# EAGLE design sst_ur_01 (EAGLE 6.5.0)
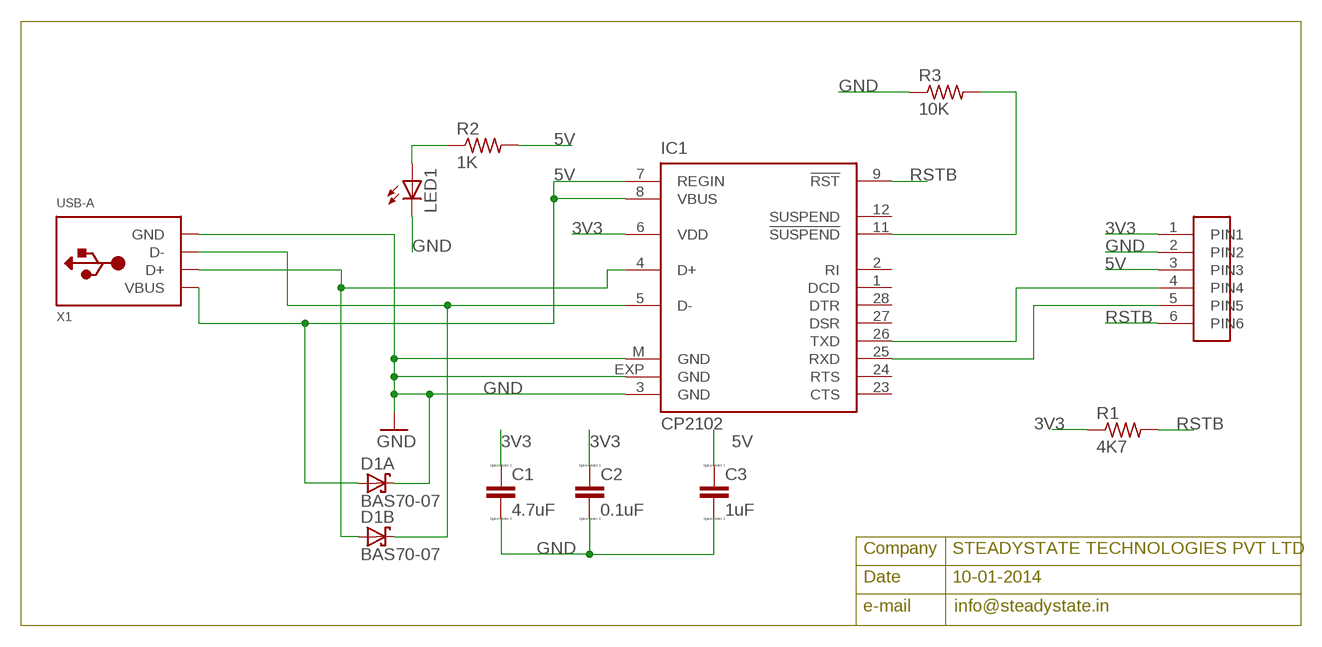
[diagram p0: schematic, sheet 1]

## Parts
C1  4.7uF  CC3216  [C3216]
C2  0.1uF  CC1206  [C1206]
C3  1uF  CC1206  [C1206]
D1  BAS70-07  [SOT143-R]
IC1  CP2102  [MLP28]
LED1  LEDCHIPLED_1206  [CHIPLED_1206]
R1  4K7  R-US_R1210  [R1210]
R2  1K  R-US_R1210  [R1210]
R3  10K  R-US_R1210  [R1210]
U$1  SIL6  [SIL6]
X1  USB-A  [MOLEX_480371000]

## Nets
3V3: C1.1 C2.1 IC1.6(VDD) R1.1 U$1.1(PIN1)
5V: C3.1 D1.4(A:A) IC1.7(REGIN) IC1.8(VBUS) R2.2 U$1.3(PIN3) X1.1(VBUS)
GND: C1.2 C2.2 C3.2 D1.1(A:C) IC1.3(GND) IC1.EXP(GND) IC1.M(GND) LED1.C R3.1 U$1.2(PIN2) X1.4(GND)
N$1: D1.2(B:C) IC1.5(D-) X1.2(D-)
N$2: IC1.11(!SUSPEND) R3.2
N$3: D1.3(B:A) IC1.4(D+) X1.3(D+)
N$4: LED1.A R2.1
N$7: IC1.26(TXD) U$1.4(PIN4)
N$8: IC1.25(RXD) U$1.5(PIN5)
RSTB: IC1.9(!RST) R1.2 U$1.6(PIN6)
Unconnected: IC1.1(DCD) IC1.2(RI) IC1.12(SUSPEND) IC1.23(CTS) IC1.24(RTS) IC1.27(DSR) IC1.28(DTR)

## Notes on the sheet
- Company | STEADYSTATE TECHNOLOGIES PVT LTD
- Date | 10-01-2014
- e-mail | info@steadystate.in

## Library data of the parts
C1-C3 = eagle-ltspice:C: CAPACITOR, European symbol; SPICEMODEL: NONE; SPICEPREFIX: C
D1 = diode:BAS70-07: Silicon Schottky Diodes General-purpose diode for high-speed switching Source: BAS70_1PS7XSB70_SER_8.pdf
IC1 = silabs:CP210*: Single-Chip USB to UART Bridge Source: www.silabs.com .. CP2101.pdf / cp2102.pdf; MF: FARNELL; MPN: CP2102-GM; OC_FARNELL: 9282130; OC_NEWARK: 30K5635
LED1 = adafruit:LED: LED OSRAM: - CHIPLED LG R971, LG N971, LY N971, LG Q971, LY Q971, LO R971, LY R971 LH N974, LH R974 LS Q976, LO Q976, LY Q976 LO Q996 - Hyper CHIPLED LW Q18S LB Q993, LB Q99A, LB R99A - SideLED LS A670, LO A670, LY A670, LG A670, LP A670 LB A673, LV A673, LT A673, LW A673 LH A674 LY A675 LS A676, LA A676, LO A676, LY A676, LW A676 LS A679, LY A679, LG A679 - Hyper Micro SIDELED® LS Y876, LA Y876, LO Y876, LY Y876 LT Y87S - SmartLED LW L88C, LW L88S LB L89C, LB L89S, LG L890 LS L89K, LO L89K, LY L89K LS L896, LA L896, LO L896, LY L896 - TOPLED LS T670, LO T670, LY T670, LG T670, LP T670 LSG T670, LSP T670, LSY T670, LOP T670, LYG T670 LG T671, LOG T671, LSG T671 LB T673, LV T673, LT T673, LW T673 LH T674 LS T676, LA T676, LO T676, LY T676, LB T676, LH T676, LSB T676, LW T676 LB T67C, LV T67C, LT T67C, LS T67K, LO T67K, LY T67K, LW E67C LS E67B, LA E67B, LO E67B, LY E67B, LB E67C, LV E67C, LT E67C LW T67C LS T679, LY T679, LG T679 LS T770, LO T770, LY T770, LG T770, LP T770 LB T773, LV T773, LT T773, LW T773 LH T774 LS E675, LA E675, LY E675, LS T675 LS T776, LA T776, LO T776, LY T776, LB T776 LHGB T686 LT T68C, LB T68C - Hyper Mini TOPLED® LB M676 - Mini TOPLED Santana® LG M470 LS M47K, LO M47K, LY M47K Source: http://www.osram.convergy.de/
R1-R3 = resistor:R-US_: RESISTOR, American symbol
U$1 = SIL_SST:SIL6
X1 = adafruit:USB-A: USB type A 'plug' Used for things that can directly connect to a USB port, say USB key

## Net classes
1 5V: width 0.381 mm, clearance 0.254 mm

## Board
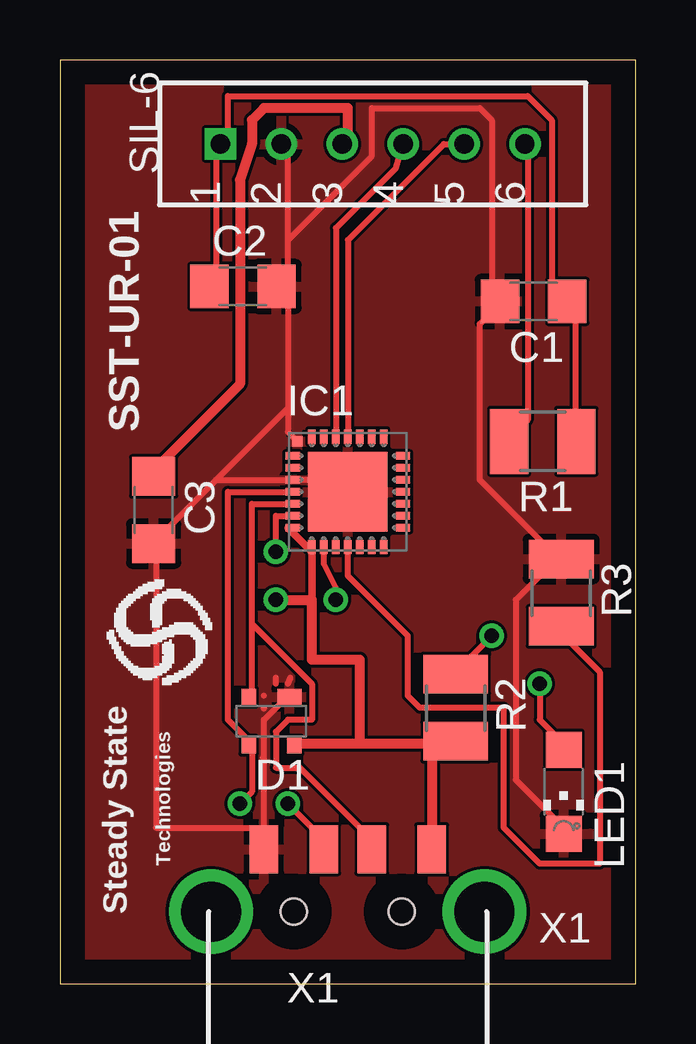
[diagram p1: board, top side]
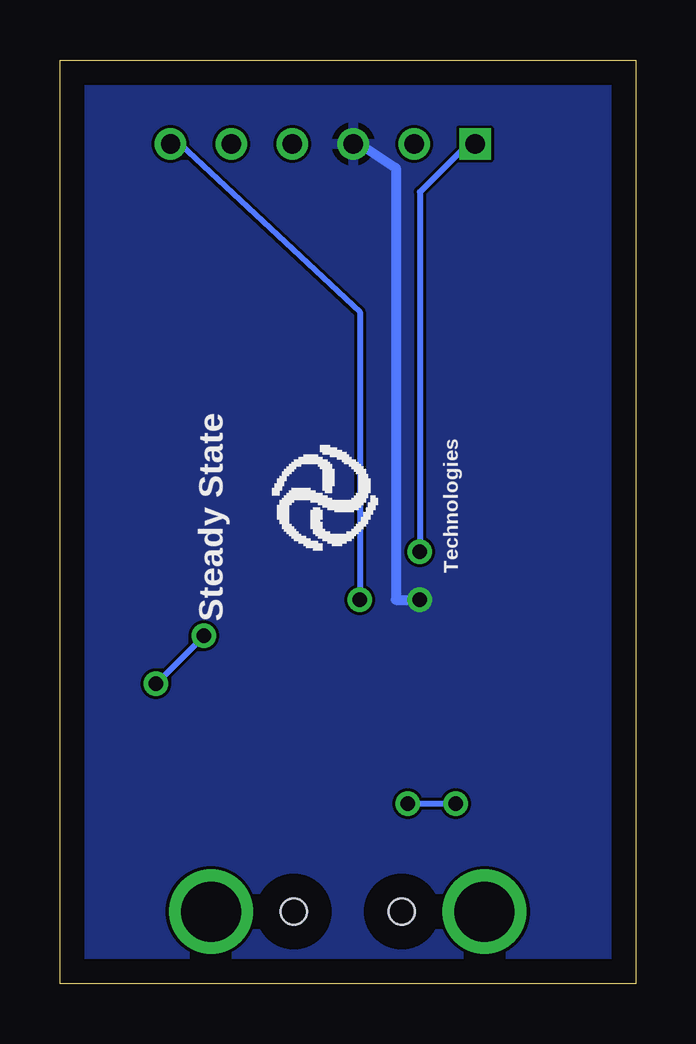
[diagram p2: board, bottom side, seen from below]

Size 24 x 38.5 mm. Coordinates in mm from the lower left corner, seen from the top.
Outline: 0,0 24,0 24,38.5 0,38.5 0,0
Copper layers (1*16): Top 0.035mm / dielectric 1.5mm / Bottom 0.035mm
Design rules "default *": minimum track width 10mil, minimum drill 24mil, track to track 5mil, track to pad 5mil, pad to pad 5mil, via to via 5mil, smd to smd 5mil, copper to edge 40mil, drill to drill 8mil, minimum pad ring 10mil, minimum via ring 8mil, stop-mask expansion 4mil, vias tented up to drill 0mil, thermal gap 10mil

### Footprints (pad centres in the part's own frame; a part is rotated, then mirrored left to right if it is on the bottom)
C3216 = smd 1.6 x 1.8: 1 -1.4,0; 2 1.4,0
C1206 = smd 1.6 x 1.8: 1 -1.4,0; 2 1.4,0
SOT143-R = smd 1 x 0.7: 1 -0.75,-1 | smd 0.6 x 0.7: 2 0.95,-1; 3 0.95,1; 4 -0.95,1
MLP28 = smd 0.6 x 0.3: 1 -2.3,1.5; 2 -2.3,1; 3 -2.3,0.5; 4 -2.3,0; 5 -2.3,-0.5; 6 -2.3,-1; 7 -2.3,-1.5; 15 2.3,-1.5; 16 2.3,-1; 17 2.3,-0.5; 18 2.3,0; 19 2.3,0.5; 20 2.3,1; 21 2.3,1.5 | smd 0.3 x 0.6: 8 -1.5,-2.3; 9 -1,-2.3; 10 -0.5,-2.3; 11 0,-2.3; 12 0.5,-2.3; 13 1,-2.3; 14 1.5,-2.3; 22 1.5,2.3; 23 1,2.3; 24 0.5,2.3; 25 0,2.3; 26 -0.5,2.3; 27 -1,2.3; 28 -1.5,2.3 | smd 3.3 x 3.3: EXP 0,0 | smd 0.435 x 0.435: M -2.103,2.103
CHIPLED_1206 = smd 1.5 x 1.5: A 0,-1.75; C 0,1.75
R1210 = smd 1.6 x 2.7: 1 -1.4,0; 2 1.4,0
SIL6 = drill 0.8 square: 1 0,3.81 | drill 0.8: 2 0,1.27; 3 0,-1.27; 4 0,-3.81; 5 0,-6.35; 6 0,-8.89
MOLEX_480371000 = smd 1.2 x 2: 1 3.5,2.6; 2 1,2.6; 3 -1,2.6; 4 -3.5,2.6 | drill 2.5: M1 -5.7,0; M2 5.7,0 | hole 1.1: -2.25,0; 2.25,0

### Placement (x,y rotation side)
C1  19.75,28.44 180 top
C2  7.63,29.06 0 top
C3  3.91,19.74 270 top
D1  8.82,10.94 180 top
IC1  12,20.5 0 top
LED1  21,8 180 top
R1  20.13,22.6 180 top
R2  16.5,11.5 270 top
R3  20.9,16.29 270 top
U$1  10.5,35 90 top
X1  12,3 0 top

### Tracks (layer width: path | path; a pad name or v marks a point on that pad's centre or on a via)
3V3  (via drill 0.61)
  Top 0.254: R1.1 21.5,23 21.5,28 C1.1 21,28.5 20.5,29 20.5,36 19.5,37 7,37 7,35.5 U$1.1 6.5,35 6.5,29.5 C2.1 | IC1.6 9,19.5 v9,18
  Bottom 0.254: v9,18 9,33 7,35 U$1.1
5V  (via drill 0.61)
  Top 0.254: 16.5,10 R2.2
  Top 0.305: 10.5,18 9.5,19 IC1.7 | 10.5,16 10.5,18 | 10.5,18 IC1.8
  Top 0.406: 16.5,10 15.5,10 | 15.5,10 12.5,10 | 12.5,10 10,10 D1.4 | 12.5,10 12.5,13.5 10.5,13.5 10.5,16 v9,16 | 15.5,10 X1.1 | C3.1 4,21.5 7.5,25 7.5,33.5 8,35 8,36 8.5,36.5 12,36.5 12,35.5 U$1.3
  Bottom 0.406: v9,16 10,16 10,34 11.5,35 U$1.3
  pour Bottom: 0,0 24,0 24,38.5 0,38.5
GND
  Top 0.254: LED1.C 21,6.5 19,8.5 19,16 20.5,17.5 R3.1 20.5,18 17.5,21 17.5,27.5 18,28 C1.2 18,28.5 18,36 17.5,36.5 13,36.5 13,34.5 9.5,31 | 9.5,12 8.5,11 8.5,9.5 | 8.5,6.5 8.5,9.5 | IC1.EXP 12,21 IC1.3 6.5,21 | 9.5,24 9.5,29 C2.2 9.5,29.5 9.5,31 | 9.5,24 9.5,23 IC1.M 10,22.5 | 9.5,24 6.5,21 | 6.5,21 4,18.5 C3.2 4,18 4,6.5 8.5,6.5 | 9.5,31 9.5,35 U$1.2 | 8.5,6 X1.4 | 9.5,12.5 9.61,12.75 | 8.5,9.5 8.46,9.41 | 9.5,12 D1.1 | 9.5,12 9.57,12 | 8.5,11.5 8.5,11.45 | X1.4 8.5,5.5 8.6,5.7 | 8.5,6.5 X1.4 | 9,12.5 9.01,12.75 | 8.5,12
  pour Top: 0,0 24,0 24,38.5 0,38.5
N$1
  Top 0.254: IC1.5 8,20 8,15 | 8,15 8,12 D1.2 | 8,15 10.5,12.5 10.5,11 9.5,11 9,10.5 9,9 10,9 13,6 X1.2
N$2
  Top 0.254: IC1.11 12,17 14.5,14.5 14.5,12 15,11.5 18.5,11.5 18.5,6.5 20,5 22.5,5 22.5,13 21,14.5 R3.2
N$3  (via drill 0.61)
  Top 0.254: IC1.4 7,20.5 7,11 8,10 | v9.5,7.5 11,6 X1.3 | v7.5,7.5 8,8 8,10 | 8,10 D1.3
  Bottom 0.254: v7.5,7.5 v9.5,7.5
N$4  (via drill 0.61)
  Top 0.254: v20,12.5 20,11 21,10 LED1.A | v18,14.5 16.5,13 R2.1
  Bottom 0.254: v18,14.5 v20,12.5
N$7
  Top 0.254: IC1.26 11.5,31.5 14,34 U$1.4
N$8
  Top 0.254: IC1.25 12,31 16,35 U$1.5
RSTB  (via drill 0.61)
  Top 0.254: IC1.9 11,17.5 11.5,16.5 v11.5,16 | R1.2 19,23 19.5,23.5 19.5,35 U$1.6
  Bottom 0.254: v11.5,16 11.5,28 19,35 U$1.6

### Text on the board
_tsilk: 1 | 2 | 3 | 4 | 5 | 6 | C2 | C1 | IC1 | SST-UR-01 | C3 | R1 | R3 | R2 | D1 | LED1 | Technologies | Steady State | X1
_bsilk: Technologies | Steady State